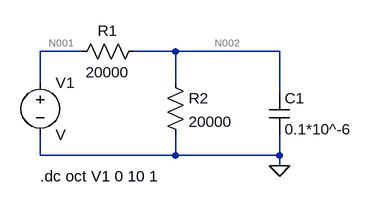
[diagram p0: schematic Prelab2.asc]
Prelab2.asc, the LTspice schematic file:
Version 4
SHEET 1 880 680
WIRE 64 80 0 80
WIRE 208 80 144 80
WIRE 368 80 208 80
WIRE 0 128 0 80
WIRE 208 128 208 80
WIRE 368 144 368 80
WIRE 0 240 0 208
WIRE 208 240 208 208
WIRE 208 240 0 240
WIRE 368 240 368 208
WIRE 368 240 208 240
WIRE 368 256 368 240
FLAG 368 256 0
SYMBOL voltage 0 112 R0
SYMATTR InstName V1
SYMBOL res 160 64 R90
WINDOW 0 0 56 VBottom 2
WINDOW 3 32 56 VTop 2
SYMATTR InstName R1
SYMATTR Value 20000
SYMBOL res 192 112 R0
SYMATTR InstName R2
SYMATTR Value 20000
SYMBOL cap 352 144 R0
SYMATTR InstName C1
SYMATTR Value 0.1*10^-6
TEXT 0 272 Left 2 !.dc oct V1 0 10 1

The netlist it stands for:
* Prelab2.asc
V1 N001 0 V
R1 N002 N001 20000
R2 N002 0 20000
C1 N002 0 0.1*10^-6
.dc oct V1 0 10 1
.backanno
.end

* Results of the author's LTspice run, read from the files saved beside the schematic
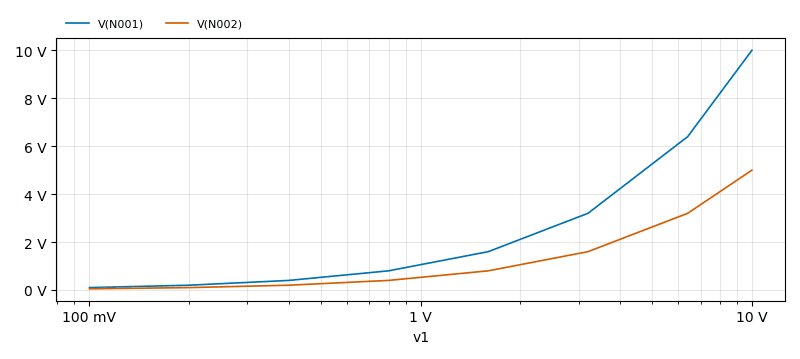
[diagram p1: DC transfer characteristic of Prelab2.asc, plotted from the saved traces]
* DC transfer characteristic, 1 run:
*   V(N001): 100 mV at v1=100 mV, 10 V at v1=10 V, min 100 mV, max 10 V
*   V(N002): 50 mV at v1=100 mV, 5 V at v1=10 V, min 50 mV, max 5 V